# EAGLE schematic System critical signals PCB (EAGLE 9.6.2)
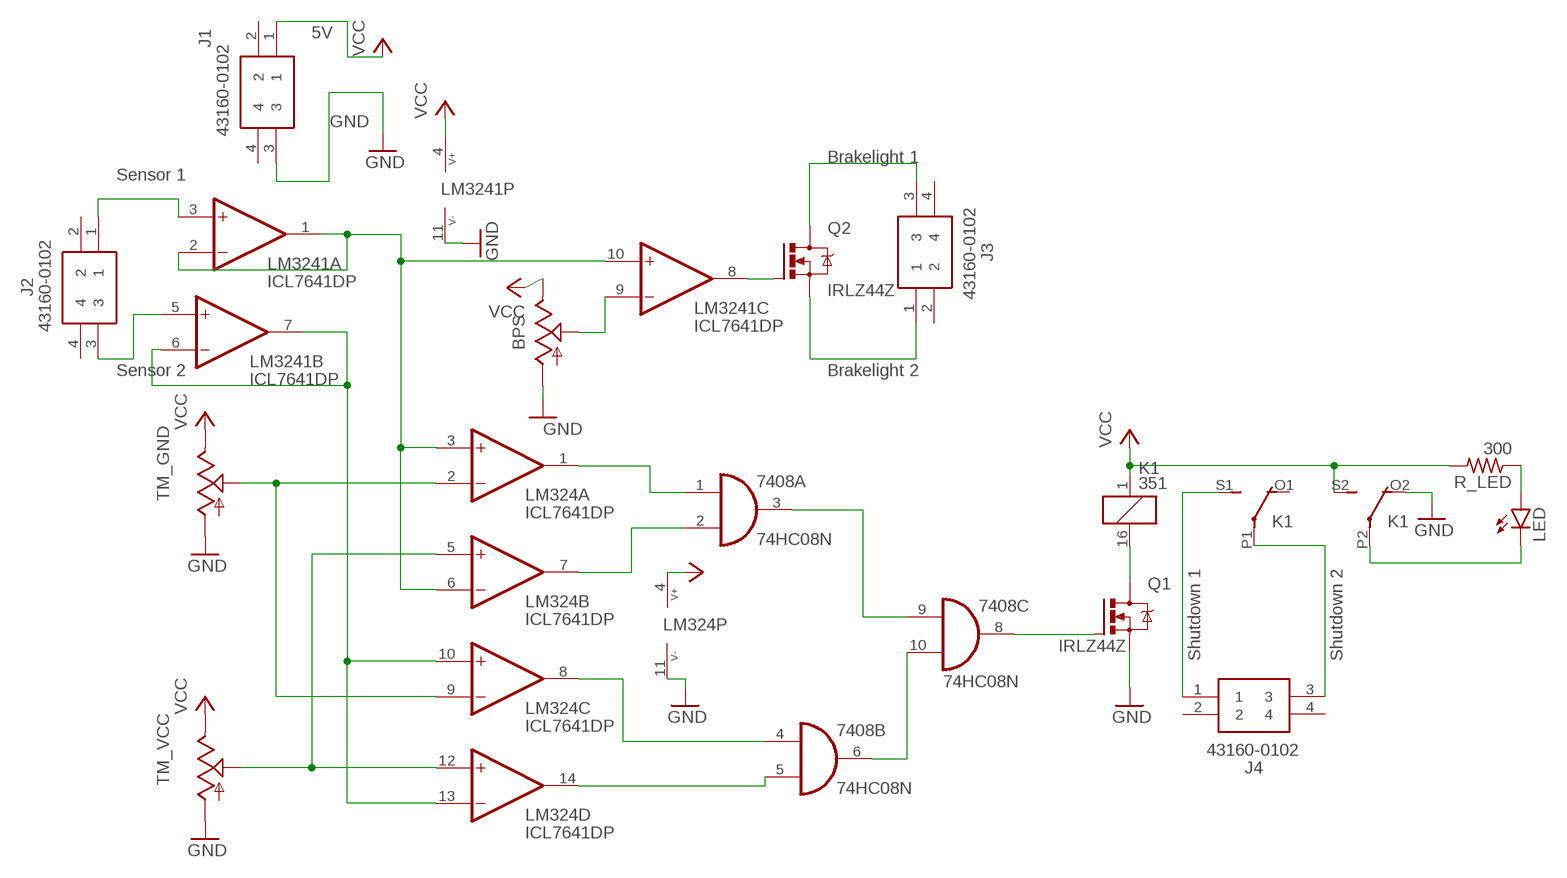
[diagram p0: schematic, sheet 1]

## Parts
7408  74HC08N  [DIL14]
BPS  TRIM  [6MM]
J1  43160-0102  [431600102]
J2  43160-0102  [431600102]
J3  43160-0102  [431600102]
J4  43160-0102  [431600102]
K1  351  [351]
LED  LEDCHIP-LED0805  [CHIP-LED0805]
LM324  ICL7641DP  [DIL14]
LM3241  ICL7641DP  [DIL14]
Q1  IRLZ44Z  [TO220BH]
Q2  IRLZ44Z  [TO220BH]
R_LED  300  R-US_M0805  [M0805]
TM_GND  TRIM  [6MM]
TM_VCC  TRIM  [6MM]

## Nets
GND: BPS.A J1.3 K1.O2(3:O) LM324.11(P:V-) LM3241.11(P:V-) Q1.S TM_GND.A TM_VCC.A
N$1: 7408.4(B:I0) LM324.8(C:OUT)
N$2: LM324.3(A:+IN) LM324.6(B:-IN) LM3241.1(A:OUT) LM3241.2(A:-IN) LM3241.10(C:+IN)
N$3: LM324.10(C:+IN) LM324.13(D:-IN) LM3241.6(B:-IN) LM3241.7(B:OUT)
N$4: 7408.5(B:I1) LM324.14(D:OUT)
N$5: 7408.1(A:I0) LM324.1(A:OUT)
N$6: 7408.2(A:I1) LM324.7(B:OUT)
N$7: 7408.3(A:O) 7408.9(C:I0)
N$8: 7408.6(B:O) 7408.10(C:I1)
N$9: 7408.8(C:O) Q1.G
N$10: K1.16 Q1.D
N$11: J4.1 K1.S1(2:S)
N$12: J4.3 K1.P1(2:P)
N$13: LED.A R_LED.1
N$14: BPS.S LM3241.9(C:-IN)
N$15: LM3241.8(C:OUT) Q2.G
N$16: J3.3 Q2.D
N$17: J3.1 Q2.S
N$18: K1.P2(3:P) LED.C
N$19: J2.1 LM3241.3(A:+IN)
N$20: J2.3 LM3241.5(B:+IN)
N$23: LM324.2(A:-IN) LM324.9(C:-IN) TM_GND.S
N$25: LM324.5(B:+IN) LM324.12(D:+IN) TM_VCC.S
VCC: BPS.E J1.1 K1.1 K1.S2(3:S) LM324.4(P:V+) LM3241.4(P:V+) R_LED.2 TM_GND.E TM_VCC.E
Unconnected: 7408.11(D:O) 7408.12(D:I0) 7408.13(D:I1) J1.2 J1.4 J2.2 J2.4 J3.2 J3.4 J4.2 J4.4 K1.O1(2:O) LM3241.12(D:+IN) LM3241.13(D:-IN) LM3241.14(D:OUT)

## Notes on the sheet
- 5V
- GND
- Brakelight 1
- Sensor 1
- Sensor 2 | Brakelight 2
- Shutdown 1 | Shutdown 2

## Power pins joined to a net without a drawn wire
GND: 7408.7(P:GND)
VCC: 7408.14(P:VCC)

## Library data of the parts
7408 = 74xx-eu:74*08: Quad 2-input AND gate
BPS TM_GND TM_VCC = adafruit:TRIM
J1-J4 = 43160-0102:43160-0102: Molex SABRE 43160, 7.5mm Pitch, 2 Way, 1 Row PCB Header, Through Hole Source: Datasheet <https://componentsearchengine.com/Datasheets/1/43160-0102.pdf>; DESCRIPTION: Molex SABRE 43160, 7.5mm Pitch, 2 Way, 1 Row PCB Header, Through Hole; HEIGHT: 14.86mm; MANUFACTURER_NAME: Molex; MANUFACTURER_PART_NUMBER: 43160-0102; MOUSER_PART_NUMBER: 538-43160-0102; MOUSER_PRICE-STOCK: https://www.mouser.co.uk/ProductDetail/Molex/43160-0102?qs=P7cO%252B%252BFDLzSKycDBXp4ZKQ%3D%3D
K1 = relay:351: RELAY 2 x switch, Omron; OC_FARNELL: unknown; OC_NEWARK: unknown
LED = led:LED: LED OSRAM: - CHIPLED LG R971, LG N971, LY N971, LG Q971, LY Q971, LO R971, LY R971 LH N974, LH R974 LS Q976, LO Q976, LY Q976 LO Q996 - Hyper CHIPLED LW Q18S LB Q993, LB Q99A, LB R99A - SideLED LS A670, LO A670, LY A670, LG A670, LP A670 LB A673, LV A673, LT A673, LW A673 LH A674 LY A675 LS A676, LA A676, LO A676, LY A676, LW A676 LS A679, LY A679, LG A679 - Hyper Micro SIDELED® LS Y876, LA Y876, LO Y876, LY Y876 LT Y87S - SmartLED LW L88C, LW L88S LB L89C, LB L89S, LG L890 LS L89K, LO L89K, LY L89K LS L896, LA L896, LO L896, LY L896 - TOPLED LS T670, LO T670, LY T670, LG T670, LP T670 LSG T670, LSP T670, LSY T670, LOP T670, LYG T670 LG T671, LOG T671, LSG T671 LB T673, LV T673, LT T673, LW T673 LH T674 LS T676, LA T676, LO T676, LY T676, LB T676, LH T676, LSB T676, LW T676 LB T67C, LV T67C, LT T67C, LS T67K, LO T67K, LY T67K, LW E67C LS E67B, LA E67B, LO E67B, LY E67B, LB E67C, LV E67C, LT E67C LW T67C LS T679, LY T679, LG T679 LS T770, LO T770, LY T770, LG T770, LP T770 LB T773, LV T773, LT T773, LW T773 LH T774 LS E675, LA E675, LY E675, LS T675 LS T776, LA T776, LO T776, LY T776, LB T776 LHGB T686 LT T68C, LB T68C - Hyper Mini TOPLED® LB M676 - Mini TOPLED Santana® LG M470 LS M47K, LO M47K, LY M47K Source: http://www.osram.convergy.de LUXEON: - LUMILED® LXK2-PW12-R00, LXK2-PW12-S00, LXK2-PW14-U00, LXK2-PW14-V00 LXK2-PM12-R00, LXK2-PM12-S00, LXK2-PM14-U00 LXK2-PE12-Q00, LXK2-PE12-R00, LXK2-PE12-S00, LXK2-PE14-T00, LXK2-PE14-U00 LXK2-PB12-K00, LXK2-PB12-L00, LXK2-PB12-M00, LXK2-PB14-N00, LXK2-PB14-P00, LXK2-PB14-Q00 LXK2-PR12-L00, LXK2-PR12-M00, LXK2-PR14-Q00, LXK2-PR14-R00 LXK2-PD12-Q00, LXK2-PD12-R00, LXK2-PD12-S00 LXK2-PH12-R00, LXK2-PH12-S00 LXK2-PL12-P00, LXK2-PL12-Q00, LXK2-PL12-R00 Source: www.luxeon.com KINGBRIGHT: KA-3528ASYC Source: www.kingbright.com
LM324 LM3241 = maxim:ICL764*: Quad Operational Amplifiers Source: http://datasheets.maxim-ic.com/en/ds/ICL7612-ICL764X.pdf; OC_FARNELL: unknown; OC_NEWARK: unknown
Q1 Q2 = transistor-power:IRLZ44Z: N-Channel HEXFET® Power MOSFET Logic Level AUTOMOTIVE MOSFET Source: http://www.irf.com/product-info/datasheets/data/irlz44zpbf.pdf
R_LED = rcl:R-US_: RESISTOR, American symbol; SPICEPREFIX: R